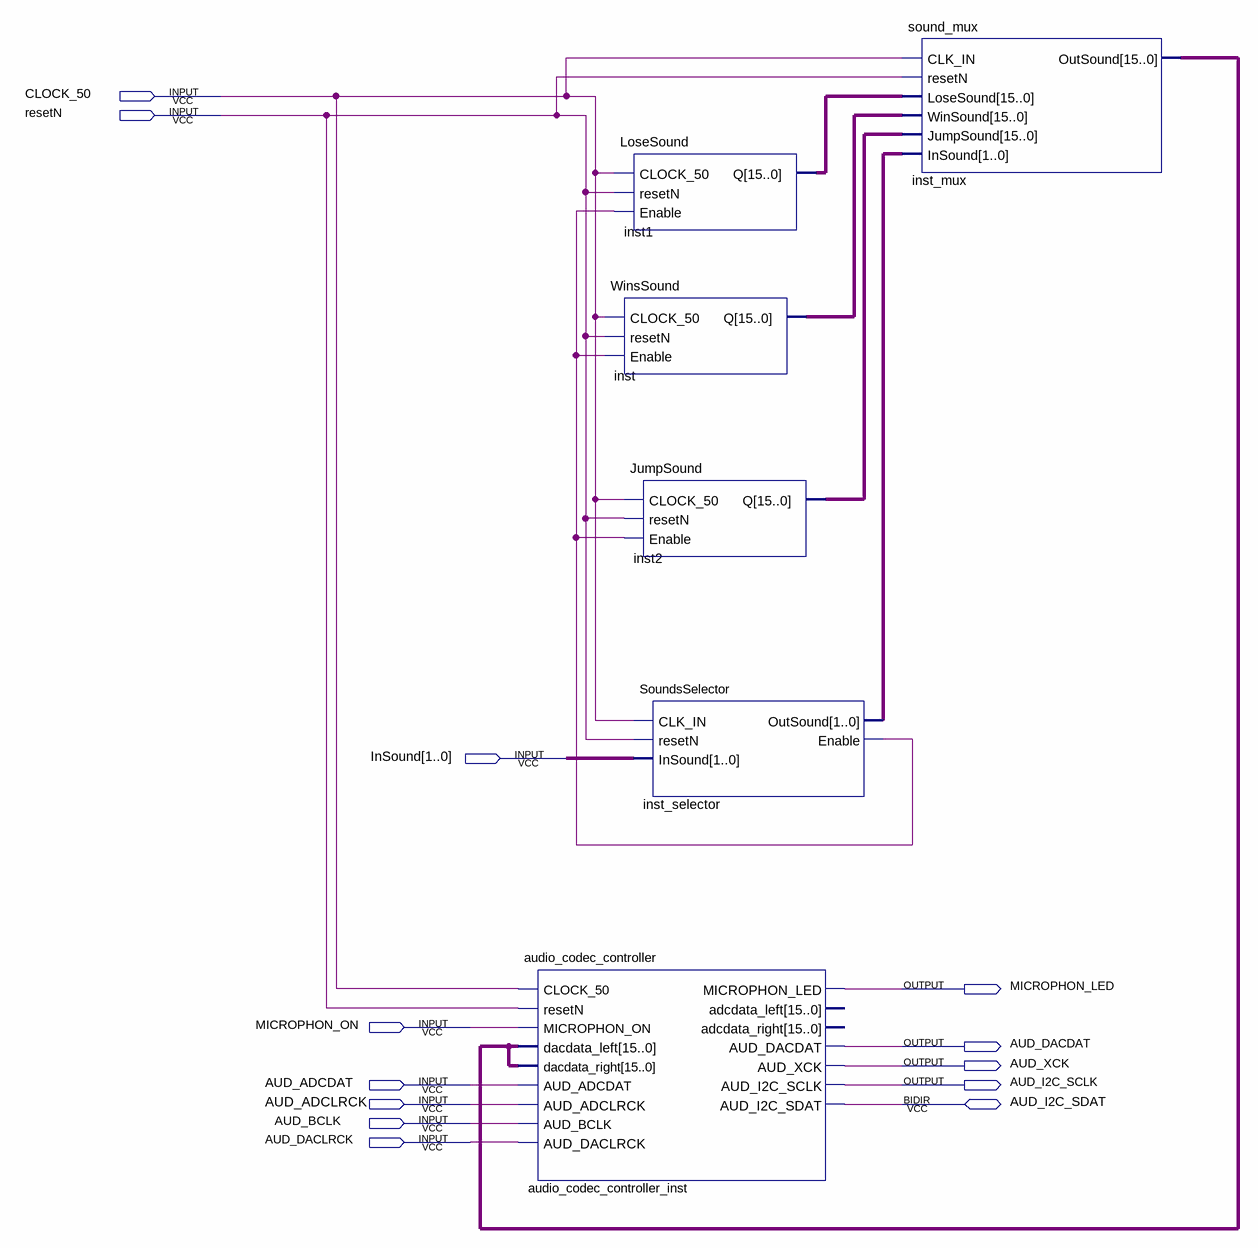
[diagram p0: schematic sheet]
// Quartus schematic Sounds.bdf as structural Verilog: 6 symbols, 13 pins
module Sounds (
  input  CLOCK_50,
  input  resetN,
  input  [1:0] InSound,
  input  MICROPHON_ON,
  input  AUD_ADCDAT,
  input  AUD_ADCLRCK,
  input  AUD_BCLK,
  input  AUD_DACLRCK,
  inout  AUD_I2C_SDAT,
  output MICROPHON_LED,
  output AUD_DACDAT,
  output AUD_XCK,
  output AUD_I2C_SCLK
);

  wire inst_selector_enable;
  wire [1:0] inst_selector_outsound;
  wire [15:0] inst1_q, inst2_q, inst_mux_outsound, inst_q;

  audio_codec_controller audio_codec_controller_inst (
    .CLOCK_50(CLOCK_50), .resetN(resetN), .MICROPHON_ON(MICROPHON_ON), .dacdata_left(inst_mux_outsound),
    .dacdata_right(inst_mux_outsound), .AUD_ADCDAT(AUD_ADCDAT), .AUD_ADCLRCK(AUD_ADCLRCK),
    .AUD_BCLK(AUD_BCLK), .AUD_DACLRCK(AUD_DACLRCK), .MICROPHON_LED(MICROPHON_LED), .AUD_DACDAT(AUD_DACDAT),
    .AUD_XCK(AUD_XCK), .AUD_I2C_SCLK(AUD_I2C_SCLK), .AUD_I2C_SDAT(AUD_I2C_SDAT));  // open: adcdata_left, adcdata_right
  LoseSound inst1 (.CLOCK_50(CLOCK_50), .resetN(resetN), .Enable(inst_selector_enable), .Q(inst1_q));
  WinsSound inst (.CLOCK_50(CLOCK_50), .resetN(resetN), .Enable(inst_selector_enable), .Q(inst_q));
  JumpSound inst2 (.CLOCK_50(CLOCK_50), .resetN(resetN), .Enable(inst_selector_enable), .Q(inst2_q));
  SoundsSelector inst_selector (
    .CLK_IN(CLOCK_50), .resetN(resetN), .InSound(InSound), .OutSound(inst_selector_outsound),
    .Enable(inst_selector_enable));
  sound_mux inst_mux (
    .CLK_IN(CLOCK_50), .resetN(resetN), .LoseSound(inst1_q), .WinSound(inst_q), .JumpSound(inst2_q),
    .InSound(inst_selector_outsound), .OutSound(inst_mux_outsound));
endmodule
